# Altium schematic sheet ADC.SchDoc
size A
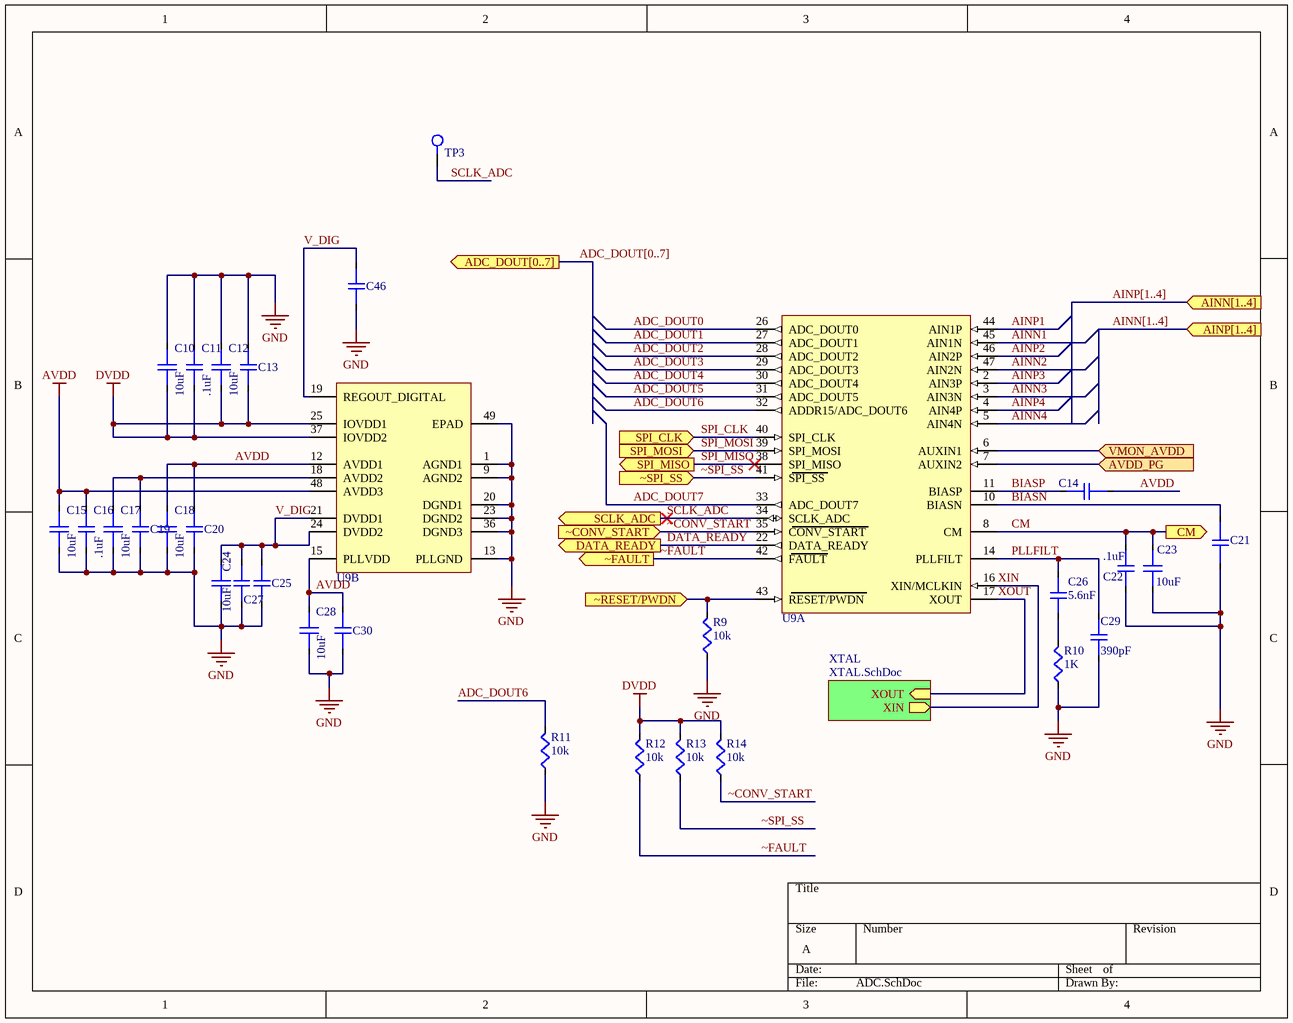
[diagram p0: ADC.SchDoc]

## Parts
C10  10uF  [C0805]
C11  .1uF  [C0603]
C12  10uF  [C0805]
C13  .1uF  [C0402]  (value not drawn)
C14  .47uF  [C0603]  (value not drawn)
C15  10uF  [C0805]
C16  .1uF  [C0603]
C17  10uF  [C0805]
C18  10uF  [C0805]
C19  .1uF  [C0402]  (value not drawn)
C20  .1uF  [C0402]  (value not drawn)
C21  .47uF  [C0603]  (value not drawn)
C22  .1uF  [C0402]
C23  10uF  [C0805]
C24  10uF  [C0805]
C25  .1uF  [C0402]  (value not drawn)
C26  5.6nF  [C0402]
C27  .1uF  [C0402]  (value not drawn)
C28  10uF  [C0805]
C29  390pF  [c0402]
C30  .1uF  [C0402]  (value not drawn)
C46  .1uF  [C0402]  (value not drawn)
R9  10k  [R0603]
R10  1K  [R0603]
R11  10k  [R0603]
R12  10k  [R0603]
R13  10k  [R0603]
R14  10k  [R0603]
TP3  TP  [TP_5029]  (value not drawn)
U9  15  [QFN50P700X700X75-49N]  (value not drawn)  (parts A,B of 2)

## Sub-sheets
XTAL = XTAL.SchDoc: XIN (out), XOUT (in)

## Ports
ADC_DOUT[0..7] (out), AINN[1..4] (in), AINP[1..4] (in), AVDD_PG (in), CM (out), DATA_READY (out), SCLK_ADC (out), SPI_CLK (in), SPI_MISO (out), SPI_MOSI (in), VMON_AVDD (in), ~CONV_START (in), ~FAULT (out), ~RESET/PWDN (in), ~SPI_SS (in)

## Nets
AVDD: C14.2 C15.2 C16.1 C18.2 C20.1 C28.2 C30.2 U9.12(AVDD1) U9.15(PLLVDD) U9.48(AVDD3)
DVDD: C10.1 C11.2 C12.1 C13.2 R12.2 R13.2 R14.2 U9.25(IOVDD1) U9.37(IOVDD2)
GND: C10.2 C11.1 C12.2 C13.1 C15.1 C16.2 C17.1 C18.1 C19.2 C20.2 C21.2 C22.1 C23.1 C24.1 C25.1 C27.1 C28.1 C29.1 C30.1 C46.1 R9.1 R10.1 R11.1 U9.1(AGND1) U9.9(AGND2) U9.13(PLLGND) U9.20(DGND1) U9.23(DGND2) U9.36(DGND3) U9.49(EPAD)
ADC_DOUT0: U9.26(ADC_DOUT0)
ADC_DOUT1: U9.27(ADC_DOUT1)
ADC_DOUT2: U9.28(ADC_DOUT2)
ADC_DOUT3: U9.29(ADC_DOUT3)
ADC_DOUT4: U9.30(ADC_DOUT4)
ADC_DOUT5: U9.31(ADC_DOUT5)
ADC_DOUT6: R11.2 U9.32(ADDR15/ADC_DOUT6)
ADC_DOUT7: U9.33(ADC_DOUT7)
AINN1: U9.45(AIN1N)
AINN2: U9.47(AIN2N)
AINN3: U9.3(AIN3N)
AINN4: U9.5(AIN4N)
AINP1: U9.44(AIN1P)
AINP2: U9.46(AIN2P)
AINP3: U9.2(AIN3P)
AINP4: U9.4(AIN4P)
AVDD_PG: U9.7(AUXIN2) ; port AVDD_PG
BIASN: C21.1 U9.10(BIASN)
BIASP: C14.1 U9.11(BIASP)
CM: C22.2 C23.2 U9.8(CM) ; port CM
DATA_READY: U9.22(DATA_READY) ; port DATA_READY
PLLFILT: C26.2 C29.2 U9.14(PLLFILT)
SCLK_ADC: TP3.1 U9.34(SCLK_ADC) ; port SCLK_ADC
SPI_CLK: U9.40(SPI_CLK) ; port SPI_CLK
SPI_MISO: U9.38(SPI_MISO) ; port SPI_MISO
SPI_MOSI: U9.39(SPI_MOSI) ; port SPI_MOSI
V_DIG: C24.2 C25.2 C27.2 C46.2 U9.19(REGOUT_DIGITAL) U9.21(DVDD1) U9.24(DVDD2)
VMON_AVDD: U9.6(AUXIN1) ; port VMON_AVDD
XIN: U9.16(XIN/MCLKIN) ; sheet XTAL/XIN
XOUT: U9.17(XOUT) ; sheet XTAL/XOUT
~CONV_START: R14.1 U9.35(CONV_START) ; port ~CONV_START
~FAULT: R12.1 U9.42(FAULT) ; port ~FAULT
~RESET/PWDN: R9.2 U9.43(RESET/PWDN) ; port ~RESET/PWDN
~SPI_SS: R13.1 U9.41(SPI_SS) ; port ~SPI_SS
NetC17_2: C17.2 C19.1 U9.18(AVDD2)
NetC26_1: C26.1 R10.2

## Buses and harness runs
bus ADC_DOUT[0..7] = port ADC_DOUT[0..7]
bus AINN[1..4] = port AINP[1..4]
bus AINP[1..4] = port AINN[1..4]

## Library data of the parts
C10 C12 C15 C17 C18 C23 C24 C28 = GCM21BR71A106KE22K: CAP CER 10UF 10V X7R 0805; Manufacturer 1: Murata; Tolerance: 10%; Supplier 1: Digi-Key; Supplier Part Number 1: 490-14531-1-ND; Manufacturer Part Number 1: GCM21BR71A106KE22K; Stock 1: 78878; Pricing 1: 1=0.57000, 10=0.40300, 100=0.26540, 500=0.19658, 1000=0.16709, 2500=0.15726, 5000=0.14744 (USD); RoHS: Yes; Mount: Surface Mount; Case/Package: 0805; Weight: 0.000335oz; Case Code (Imperial): 0805; Case Code (Metric): 2012; Min Operating Temperature: -55°C; Max Operating Temperature: 125°C; Packaging: Tape and Reel; Capacitance: 10uF; Voltage Rating: 10V; Dielectric: X7R; Termination: SMD/SMT; Voltage Rating (DC): 10V; Package Quantity: 10000; Length: 0.079inch; Height: 1.25mm; Width: 1.25mm; Thickness: 0.055inch; Ratings: AEC-Q200; ComponentLink1URL: http://www.mouser.com/ds/2/281/c03e-806517.pdf?src-supplier=Mouser; ComponentLink1Description: http://www.mouser.com/ds/2/281/c03e-806517.pdf?src-supplier=Mouser; ComponentLink2URL: http://search.murata.co.jp/Ceramy/image/img/A01X/G101/ENG/GCM21BR71A106KE22-01.pdf?src-supplier=Digi-Key; ComponentLink2Description: http://search.murata.co.jp/Ceramy/image/img/A01X/G101/ENG/GCM21BR71A106KE22-01.pdf?src-supplier=Digi-Key; ComponentLink3URL: http://search.murata.co.jp/Ceramy/image/img/A01X/partnumbering_e_02.pdf?src-supplier=Digi-Key; ComponentLink3Description: http://search.murata.co.jp/Ceramy/image/img/A01X/partnumbering_e_02.pdf?src-supplier=Digi-Key
C11 C16 = VJ0603Y104JXJCW1BC: 0603 0.1 uF 16 V ±5 % Tolerance X7R SMT Multilayer Ceramic Chip Capacitor; Manufacturer 1: Vishay Vitramon; Dielectric Material: Tantalum; Tolerance: 5%; Capacitance: 100nF; Voltage Rating: 16V; Supplier 1: Digi-Key; Supplier Part Number 1: 720-1685-1-ND; Manufacturer Part Number 1: VJ0603Y104JXJCW1BC; Stock 1: 6936; Pricing 1: 1=0.20000, 10=0.13400, 100=0.06780, 500=0.04636, 1000=0.04101 (USD); RoHS: Yes; Mount: Surface Mount; Case/Package: 0603; Number of Pins: 2; Case Code (Imperial): 0603; Case Code (Metric): 1608; Contact Plating: Tin,Matte; Min Operating Temperature: -55°C; Max Operating Temperature: 125°C; Packaging: Tape and Reel; Voltage Rating (DC): 16V; Package Quantity: 4000; Dielectric: X7R; Termination: SMD/SMT; Length: 1.6mm; Height: 0.95mm; Width: 0.8mm; Depth: 0.8mm; Lead Free: Lead Free; ComponentLink1URL: https://datasheet.ciiva.com/5424/vjw1bcbascomseries-223529-5424533.pdf?src-supplier=Mouser; ComponentLink1Description: https://datasheet.ciiva.com/5424/vjw1bcbascomseries-223529-5424533.pdf?src-supplier=Mouser; ComponentLink2URL: https://datasheet.ciiva.com/11491/vjw1bcbascomseries-11491768.pdf?src-supplier=Avnet; ComponentLink2Description: https://datasheet.ciiva.com/11491/vjw1bcbascomseries-11491768.pdf?src-supplier=Avnet; ComponentLink3URL: https://datasheet.ciiva.com/16215/vjw1bcbascomseries-16215161.pdf?src-supplier=Future+Electronics; ComponentLink3Description: https://datasheet.ciiva.com/16215/vjw1bcbascomseries-16215161.pdf?src-supplier=Future+Electronics
C13 C19 C20 C22 C25 C27 C30 C46 = GRM155R71A104JA01D: 0402 0.1 uF 10 V ±5% Tolerance X7R SMT Multilayer Ceramic Capacitor; Manufacturer 1: Murata; Capacitance: 100nF; Voltage Rating: 10V; Supplier 1: Digi-Key; Supplier Part Number 1: 490-10777-1-ND; Manufacturer Part Number 1: GRM155R71A104JA01D; Stock 1: 1113659; Pricing 1: 1=0.10000, 10=0.02800, 100=0.01240, 500=0.00886, 1000=0.00696, 2500=0.00632, 5000=0.00582 (USD); RoHS: Yes; Mount: Surface Mount; Case/Package: 0402; Case Code (Imperial): 0402; Case Code (Metric): 1005; Min Operating Temperature: -55°C; Max Operating Temperature: 125°C; Tolerance: 5%; Packaging: Tape and Reel; Voltage Rating (DC): 10V; Package Quantity: 10000; Dielectric: X7R; Termination: SMD/SMT; Length: 1mm; Height: 0.5mm; Width: 0.02inch; Depth: 0.5mm; Lead Free: Lead Free; ComponentLink1URL: https://datasheet.ciiva.com/5411/product-5411135.pdf?src-supplier=Mouser; ComponentLink1Description: https://datasheet.ciiva.com/5411/product-5411135.pdf?src-supplier=Mouser; ComponentLink2URL: https://datasheet.ciiva.com/11618/c02e-11618821.pdf?src-supplier=Avnet; ComponentLink2Description: https://datasheet.ciiva.com/11618/c02e-11618821.pdf?src-supplier=Avnet; Thickness: 0.022inch; Radiation Hardening: No
C14 C21 = C0603C474J4RACAUTO: KEMET - C0603C474J4RACAUTO - CAP, 0.47µF, 16V, 5%, X7R, 0603; Capacitance: 470nF; Supplier 1: Digi-Key; Supplier Part Number 1: 399-17596-1-ND; Manufacturer 1: KEMET; Manufacturer Part Number 1: C0603C474J4RACAUTO; Stock 1: 10040; Pricing 1: 1=0.51000, 10=0.35800, 100=0.23570, 500=0.17462, 1000=0.14842 (USD); RoHS: Yes; Case/Package: 0603; Min Operating Temperature: -55°C; Max Operating Temperature: 125°C; Tolerance: 5%; Packaging: Tape and Reel; Dielectric: X7R; Length: 1.6mm; Depth: 0.8mm; ComponentLink1URL: http://www.farnell.com/datasheets/2749769.pdf?src-supplier=Farnell; ComponentLink1Description: http://www.farnell.com/datasheets/2749769.pdf?src-supplier=Farnell; ComponentLink2URL: http://components.arrow.com/part/dataview/0323_07310140?src-supplier=Arrow+Europe; ComponentLink2Description: http://components.arrow.com/part/dataview/0323_07310140?src-supplier=Arrow+Europe; ComponentLink3URL: https://api.kemet.com/component-edge/download/datasheet/C0603C474J4RACAUTO.pdf?src-supplier=Digi-Key; ComponentLink3Description: https://api.kemet.com/component-edge/download/datasheet/C0603C474J4RACAUTO.pdf?src-supplier=Digi-Key; ComponentLink4URL: http://www.farnell.com/datasheets/2749769.pdf?src-supplier=Element14; ComponentLink4Description: http://www.farnell.com/datasheets/2749769.pdf?src-supplier=Element14; ComponentLink5URL: http://www.farnell.com/datasheets/2749769.pdf?src-supplier=Newark; ComponentLink5Description: http://www.farnell.com/datasheets/2749769.pdf?src-supplier=Newark
C26 = 04025C562JAT2A: Multilayer Ceramic Capacitors MLCC - SMD/SMT 50volts 5600pF 5% C0G; Voltage Rating (DC): 50V; Temperature Coefficient: 30ppm/°C; Dissipation Factor: 0.1%; Supplier 1: Digi-Key; Supplier Part Number 1: 478-10129-1-ND; RoHS: Yes; Mount: Surface Mount; Case/Package: 0603; Number of Pins: 2; Dielectric Material: Ceramic; Case Code (Metric): 1608; Case Code (Imperial): 0603; Min Operating Temperature: -55°C; Max Operating Temperature: 125°C; Capacitance: 5.6nF; Tolerance: 5%; Dielectric: C0G; Package Quantity: 4000; Voltage Rating: 50V; Packaging: Tape and Reel; Termination: SMD/SMT; Voltage: 50V; Length: 1.6mm; Height: 0.8mm; Width: 0.031inch; Thickness: 0.034inch; Depth: 0.8mm; Radiation Hardening: No; Lead Free: Lead Free; REACH SVHC: No SVHC; ComponentLink1URL: https://datasheet.ciiva.com/28608/1372242-28608633.pdf?src-supplier=Element14; ComponentLink1Description: https://datasheet.ciiva.com/28608/1372242-28608633.pdf?src-supplier=Element14; ComponentLink2URL: https://datasheet.ciiva.com/22705/40889-22705450.pdf?src-supplier=Element14; ComponentLink2Description: https://datasheet.ciiva.com/22705/40889-22705450.pdf?src-supplier=Element14; ComponentLink3URL: https://datasheet.ciiva.com/26847/getdatasheetpartid-385577-26847722.pdf?src-supplier=Verical; ComponentLink3Description: https://datasheet.ciiva.com/26847/getdatasheetpartid-385577-26847722.pdf?src-supplier=Verical; ComponentLink4URL: https://datasheet.ciiva.com/7823/40889-7823822.pdf?src-supplier=Element14; ComponentLink4Description: https://datasheet.ciiva.com/7823/40889-7823822.pdf?src-supplier=Element14; ComponentLink5URL: https://datasheet.ciiva.com/5448/kem-c1003-c0g-smd-356956-5448159.pdf?src-supplier=Mouser; ComponentLink5Description: https://datasheet.ciiva.com/5448/kem-c1003-c0g-smd-356956-5448159.pdf?src-supplier=Mouser
C29 = 04025C391JAT2A: CAP CER 390PF 50V C0G/NP0 0603; Dielectric Material: Ceramic; Tolerance: 5%; Dielectric: C0G; Dissipation Factor: 0.1%; Temperature Coefficient: 30ppm/°C; Supplier 1: Digi-Key; Supplier Part Number 1: 478-5269-1-ND; RoHS: Yes; Mount: Surface Mount,PCB; Case/Package: 0603; Number of Pins: 2; Case Code (Metric): 1608; Case Code (Imperial): 0603; Min Operating Temperature: -55°C; Max Operating Temperature: 125°C; Capacitance: 390pF; Voltage Rating (DC): 50V; Packaging: Tape and Reel; Package Quantity: 1; Voltage Rating: 50V; Termination: SMD/SMT; Voltage: 50V; Length: 1.6mm; Height: 0.8mm; Depth: 0.8mm; Width: 0.8mm; Thickness: 0.034inch; Lead Pitch: 0.7mm; Radiation Hardening: No; Lead Free: Lead Free; REACH SVHC: No SVHC; ComponentLink1URL: https://datasheet.ciiva.com/144/docfinderpartnumber-c0603c391j5gactu-144833.pdf?src-supplier=Digi-Key; ComponentLink1Description: https://datasheet.ciiva.com/144/docfinderpartnumber-c0603c391j5gactu-144833.pdf?src-supplier=Digi-Key; ComponentLink2URL: https://datasheet.ciiva.com/7823/40889-7823769.pdf?src-supplier=Element14; ComponentLink2Description: https://datasheet.ciiva.com/7823/40889-7823769.pdf?src-supplier=Element14; ComponentLink3URL: https://datasheet.ciiva.com/7823/40889-7823770.pdf?src-supplier=Element14; ComponentLink3Description: https://datasheet.ciiva.com/7823/40889-7823770.pdf?src-supplier=Element14; ComponentLink4URL: https://datasheet.ciiva.com/5415/kem-c1003-c0g-smd-356956-5415640.pdf?src-supplier=Mouser; ComponentLink4Description: https://datasheet.ciiva.com/5415/kem-c1003-c0g-smd-356956-5415640.pdf?src-supplier=Mouser; ComponentLink5URL: https://datasheet.ciiva.com/18102/getdatasheetpartid-77374-18102795.pdf?src-supplier=Verical; ComponentLink5Description: https://datasheet.ciiva.com/18102/getdatasheetpartid-77374-18102795.pdf?src-supplier=Verical; ComponentLink6URL: https://datasheet.ciiva.com/18219/getdatasheetpartid-385544-18219227.pdf?src-supplier=Verical; ComponentLink6Description: https://datasheet.ciiva.com/18219/getdatasheetpartid-385544-18219227.pdf?src-supplier=Verical
R9 R11-R14 = RC0603JR-0710KL: RES SMD 10K OHM 5% 1/10W 0603
R10 = TNPW06031K00BEEA: RES 1K OHM 0.1% 1/8W 0603; Manufacturer 1: Vishay Dale; Tolerance: 1%; Resistance: 1kR; Temperature Coefficient: 25ppm/°C; Power Rating: 100mW; Voltage Rating: 75V; Supplier 1: Digi-Key; Supplier Part Number 1: TNP1.00KAACT-ND; Manufacturer Part Number 1: TNPW06031K00BEEA; Stock 1: 92047; Pricing 1: 1=0.65000, 10=0.46200, 100=0.24020, 1000=0.12936, 2500=0.12760 (USD); RoHS: Yes; Mount: Surface Mount; Case/Package: 0603; Weight: 7.1E-05oz; Contact Plating: Tin; Case Code (Metric): 1608; Case Code (Imperial): 0603; Min Operating Temperature: -55°C; Max Operating Temperature: 125°C; Composition: Thin Film; Packaging: Tape and Reel; Package Quantity: 1; Number of Terminations: 2; Termination: SMD/SMT; Military Standard: Not; Max Power Dissipation: 100mW; Voltage Rating (DC): 75V; Features: Moisture Resistant,Automotive AEC-Q200,Anti-Sulfur; Length: 1.6mm; Height: 0.45mm; Width: 0.033inch; Depth: 0.85mm; Radiation Hardening: No; REACH SVHC: Unknown; Lead Free: Lead Free; ComponentLink1URL: https://datasheet.ciiva.com/2528/tnpw-e3-2528472.pdf?src-supplier=Digi-Key; ComponentLink1Description: https://datasheet.ciiva.com/2528/tnpw-e3-2528472.pdf?src-supplier=Digi-Key; ComponentLink2URL: https://datasheet.ciiva.com/2528/tnpw-e3-2528473.pdf?src-supplier=Digi-Key; ComponentLink2Description: https://datasheet.ciiva.com/2528/tnpw-e3-2528473.pdf?src-supplier=Digi-Key; ComponentLink3URL: https://datasheet.ciiva.com/9112/tnpw-e3-9112138.pdf?src-supplier=Avnet; ComponentLink3Description: https://datasheet.ciiva.com/9112/tnpw-e3-9112138.pdf?src-supplier=Avnet; ComponentLink4URL: https://datasheet.ciiva.com/16391/tnpw-e3-16391675.pdf?src-supplier=Future+Electronics; ComponentLink4Description: https://datasheet.ciiva.com/16391/tnpw-e3-16391675.pdf?src-supplier=Future+Electronics; ComponentLink5URL: https://datasheet.ciiva.com/9112/tnpw-e3-9112141.pdf?src-supplier=Avnet; ComponentLink5Description: https://datasheet.ciiva.com/9112/tnpw-e3-9112141.pdf?src-supplier=Avnet; ComponentLink6URL: https://datasheet.ciiva.com/16782/70201627-16782047.pdf?src-supplier=Allied+Electronics; ComponentLink6Description: https://datasheet.ciiva.com/16782/70201627-16782047.pdf?src-supplier=Allied+Electronics
TP3 = TP: 5029 SMD 0805 TP; Supplier 1: Digi-Key; Supplier Part Number 1: 36-5029CT-ND
U9 = ADAR7251